# EAGLE design drv8353 based bldc driver stage (EAGLE 9.5.0)

## Sheet 1 of 3: Gate Driver & Signal Headers
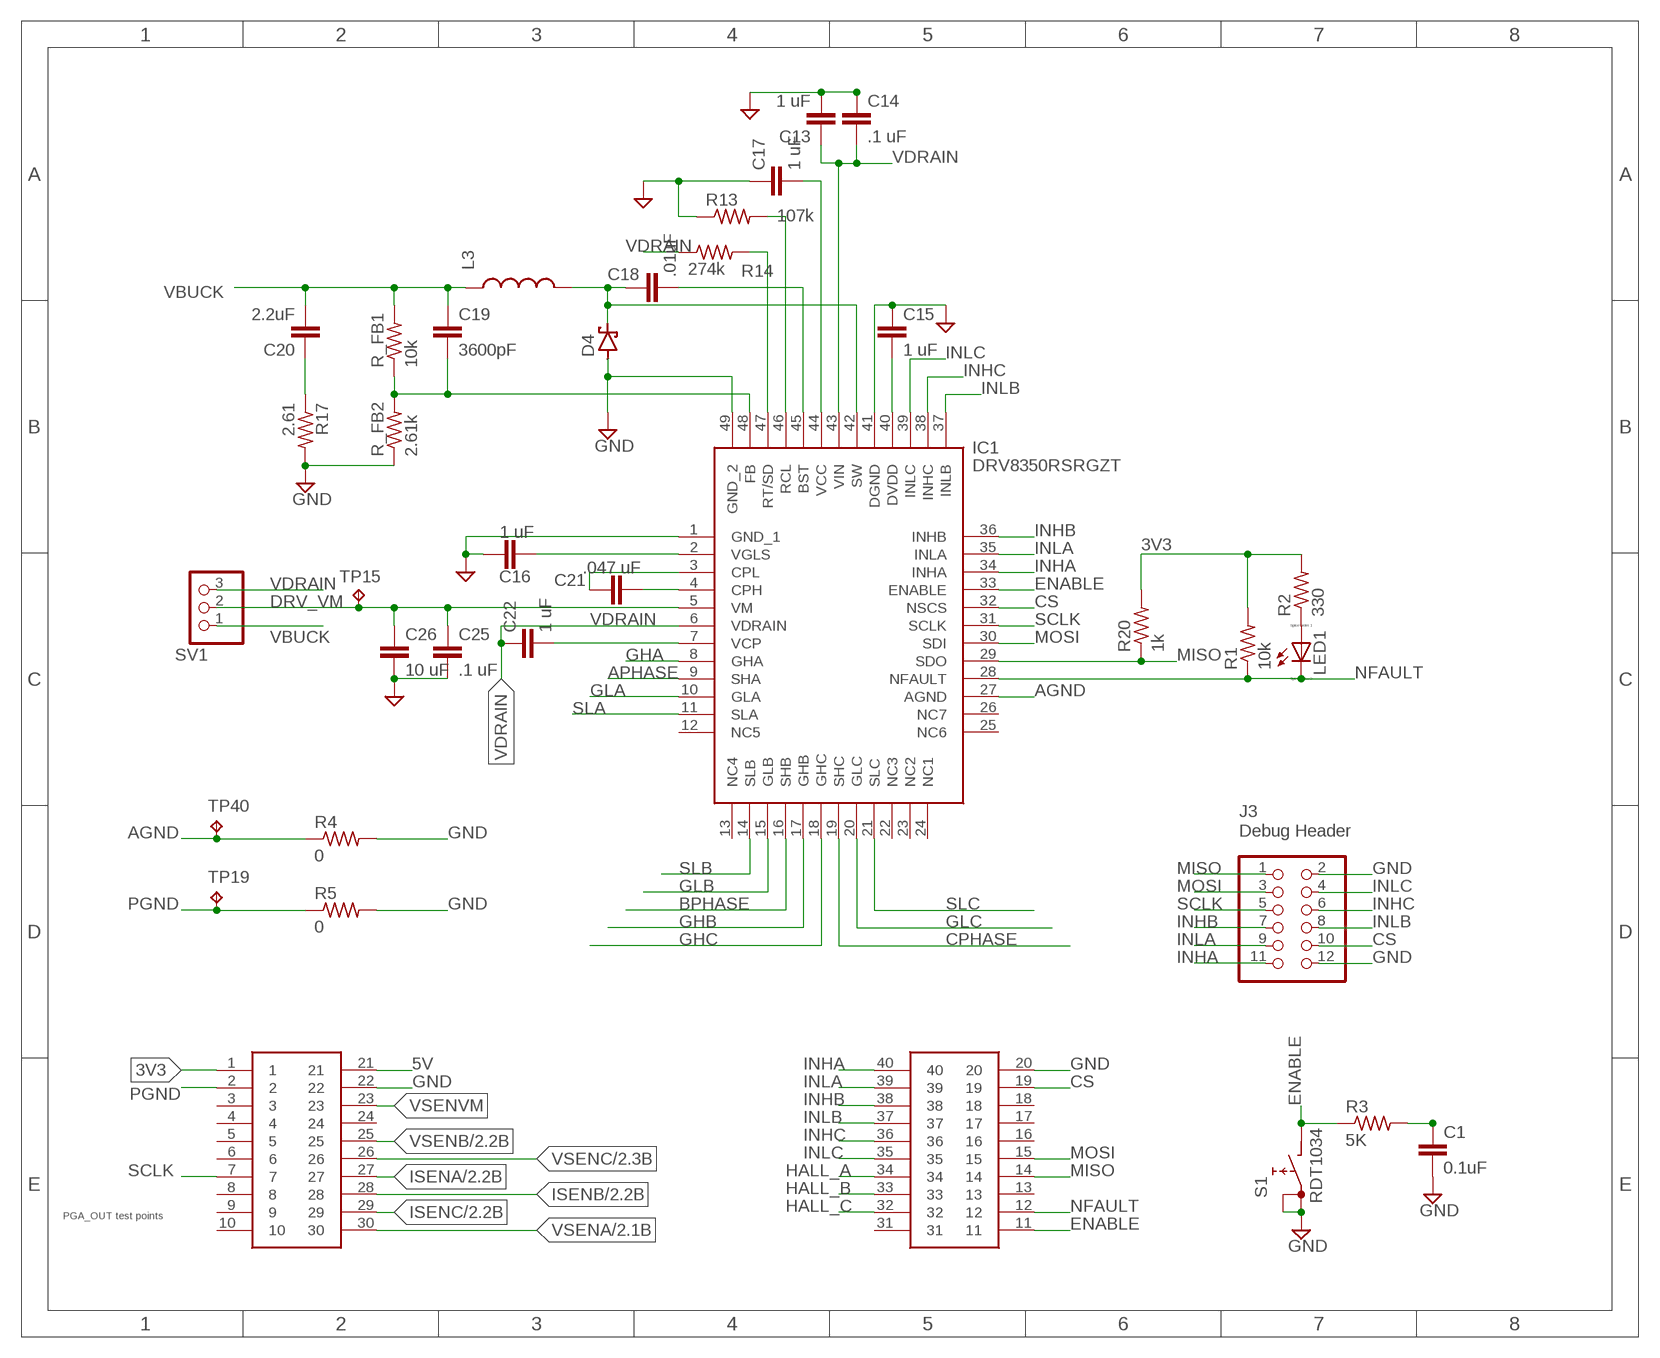
[diagram p0: schematic, sheet 1]

### Parts
C1  0.1uF  C-EUC0603K  [C0603K]
C13  1 uF  C-EUC1206K  [C1206K]
C14  .1 uF  C-EUC0805K  [C0805K]
C15  1 uF  C-EUC0603K  [C0603K]
C16  1 uF  C-EUC0603K  [C0603K]
C17  1 uF  C-EUC0603K  [C0603K]
C18  .01uF  C-EUC0603K  [C0603K]
C19  3600pF  C-EUC0603K  [C0603K]
C20  2.2uF  C-EUC0805K  [C0805K]
C21  .047 uF  C-EUC0805K  [C0805K]
C22  1 uF  C-EUC0603K  [C0603K]
C25  .1 uF  C-EUC0805K  [C0805K]
C26  10 uF  C-EUC2220K  [C2220K]
D4  DFLS1200  [DFLS1200]
IC1  DRV8350RSRGZT  [QFN50P700X700X100-49N]
J3  2X6 FEMALE  PINHD-2X6  [2X06]
L3  330 uH  74404084331  [74404084331]
LED1  LED_ESML0603  [LED_SML0603]
R1  10k  R-US_R0603  [R0603]
R2  330  R-US_R0603  [R0603]
R3  5K  R-US_R0603  [R0603]
R4  0  R-US_R0603  [R0603]
R5  0  R-US_R0603  [R0603]
R13  107k  R-US_R0603  [R0603]
R14  274k  R-US_R0603  [R0603]
R17  2.61  R-US_R0603  [R0603]
R20  1k  R-US_R0603  [R0603]
R_FB1  10k  R-US_R0603  [R0603]
R_FB2  2.61k  R-US_R0603  [R0603]
S1  RDT1034  [RDT1034]
SV1  PINHD-1X3  [1X03]
TP15  TPB1,27  [B1,27]
TP19  TPB1,27  [B1,27]
TP40  TPB1,27  [B1,27]
U$2  BOOSTER_DOCK  [BOOSTER_DOCK]

### Nets
3V3: R1.2 R2.2 R20.2 U$2.1 ; also sheet 3
5V: U$2.21 ; also sheet 3
AGND: IC1.27(AGND) R4.1 TP40.TP
APHASE: IC1.9(SHA) ; also sheet 2,3
BPHASE: IC1.16(SHB) ; also sheet 2,3
BST: C18.2 IC1.45(BST)
CPH: C21.2 IC1.4(CPH)
CPHASE: IC1.19(SHC) ; also sheet 2,3
CPL: C21.1 IC1.3(CPL)
CS: IC1.32(NSCS) J3.10 U$2.19
DRV_VM: C25.1 C26.1 IC1.5(VM) SV1.2 TP15.TP
ENABLE: IC1.33(ENABLE) R3.1 S1.B U$2.11
FB: C19.2 IC1.48(FB) R_FB1.1 R_FB2.2
GHA: IC1.8(GHA) ; also sheet 3
GHB: IC1.17(GHB) ; also sheet 3
GHC: IC1.18(GHC) ; also sheet 3
GLA: IC1.10(GLA) ; also sheet 3
GLB: IC1.15(GLB) ; also sheet 3
GLC: IC1.20(GLC) ; also sheet 3
GND: C1.2 C13.2 C14.1 C15.1 C16.1 C17.1 C25.2 C26.2 D4.GND IC1.1(GND_1) IC1.41(DGND) IC1.49(GND_2) J3.2 J3.12 R4.2 R5.2 R13.1 R17.2 R_FB2.1 S1.A S1.A1 U$2.20 U$2.22 ; also sheet 2,3
HALL_A: U$2.34 ; also sheet 3
HALL_B: U$2.33 ; also sheet 3
HALL_C: U$2.32 ; also sheet 3
INHA: IC1.34(INHA) J3.11 U$2.40
INHB: IC1.36(INHB) J3.7 U$2.38
INHC: IC1.38(INHC) J3.6 U$2.36
INLA: IC1.35(INLA) J3.9 U$2.39
INLB: IC1.37(INLB) J3.8 U$2.37
INLC: IC1.39(INLC) J3.4 U$2.35
ISENA: U$2.27 ; also sheet 2
ISENB: U$2.28 ; also sheet 2
ISENC: U$2.29 ; also sheet 2
MISO: IC1.29(SDO) J3.1 R20.1 U$2.14
MOSI: IC1.30(SDI) J3.3 U$2.15
N$1: C15.2 IC1.40(DVDD)
N$14: C20.1 R17.1
N$16: LED1.A R2.1
N$20: C1.1 R3.2
NFAULT: IC1.28(NFAULT) LED1.C R1.1 U$2.12
PGND: R5.1 TP19.TP U$2.2
RCL: IC1.46(RCL) R13.2
RT/SD: IC1.47(RT/SD) R14.2
SCLK: IC1.31(SCLK) J3.5 U$2.7
SLA: IC1.11(SLA) ; also sheet 3
SLB: IC1.14(SLB) ; also sheet 3
SLC: IC1.21(SLC) ; also sheet 3
SW: C18.1 D4.LINE IC1.42(SW) L3.P$2
VBUCK: C19.1 C20.2 L3.P$1 R_FB1.2 SV1.1 ; also sheet 3
VCC: C17.2 IC1.44(VCC)
VCP: C22.2 IC1.7(VCP)
VDRAIN [vdrain]: C13.1 C14.2 C22.1 IC1.6(VDRAIN) IC1.43(VIN) R14.1 SV1.3 ; also sheet 3
VGLS: C16.2 IC1.2(VGLS)
VSENA: U$2.30 ; also sheet 2,3
VSENB: U$2.25 ; also sheet 2,3
VSENC: U$2.26 ; also sheet 2,3
VSENVM: U$2.23 ; also sheet 3
Unconnected: IC1.12(NC5) IC1.13(NC4) IC1.22(NC3) IC1.23(NC2) IC1.24(NC1) IC1.25(NC6) IC1.26(NC7) U$2.3 U$2.4 U$2.5 U$2.6 U$2.8 U$2.9 U$2.10 U$2.13 U$2.16 U$2.17 U$2.18 U$2.24 U$2.31

### Notes on the sheet
- Debug Header
- PGA_OUT test points

## Sheet 2 of 3: Half Bridges
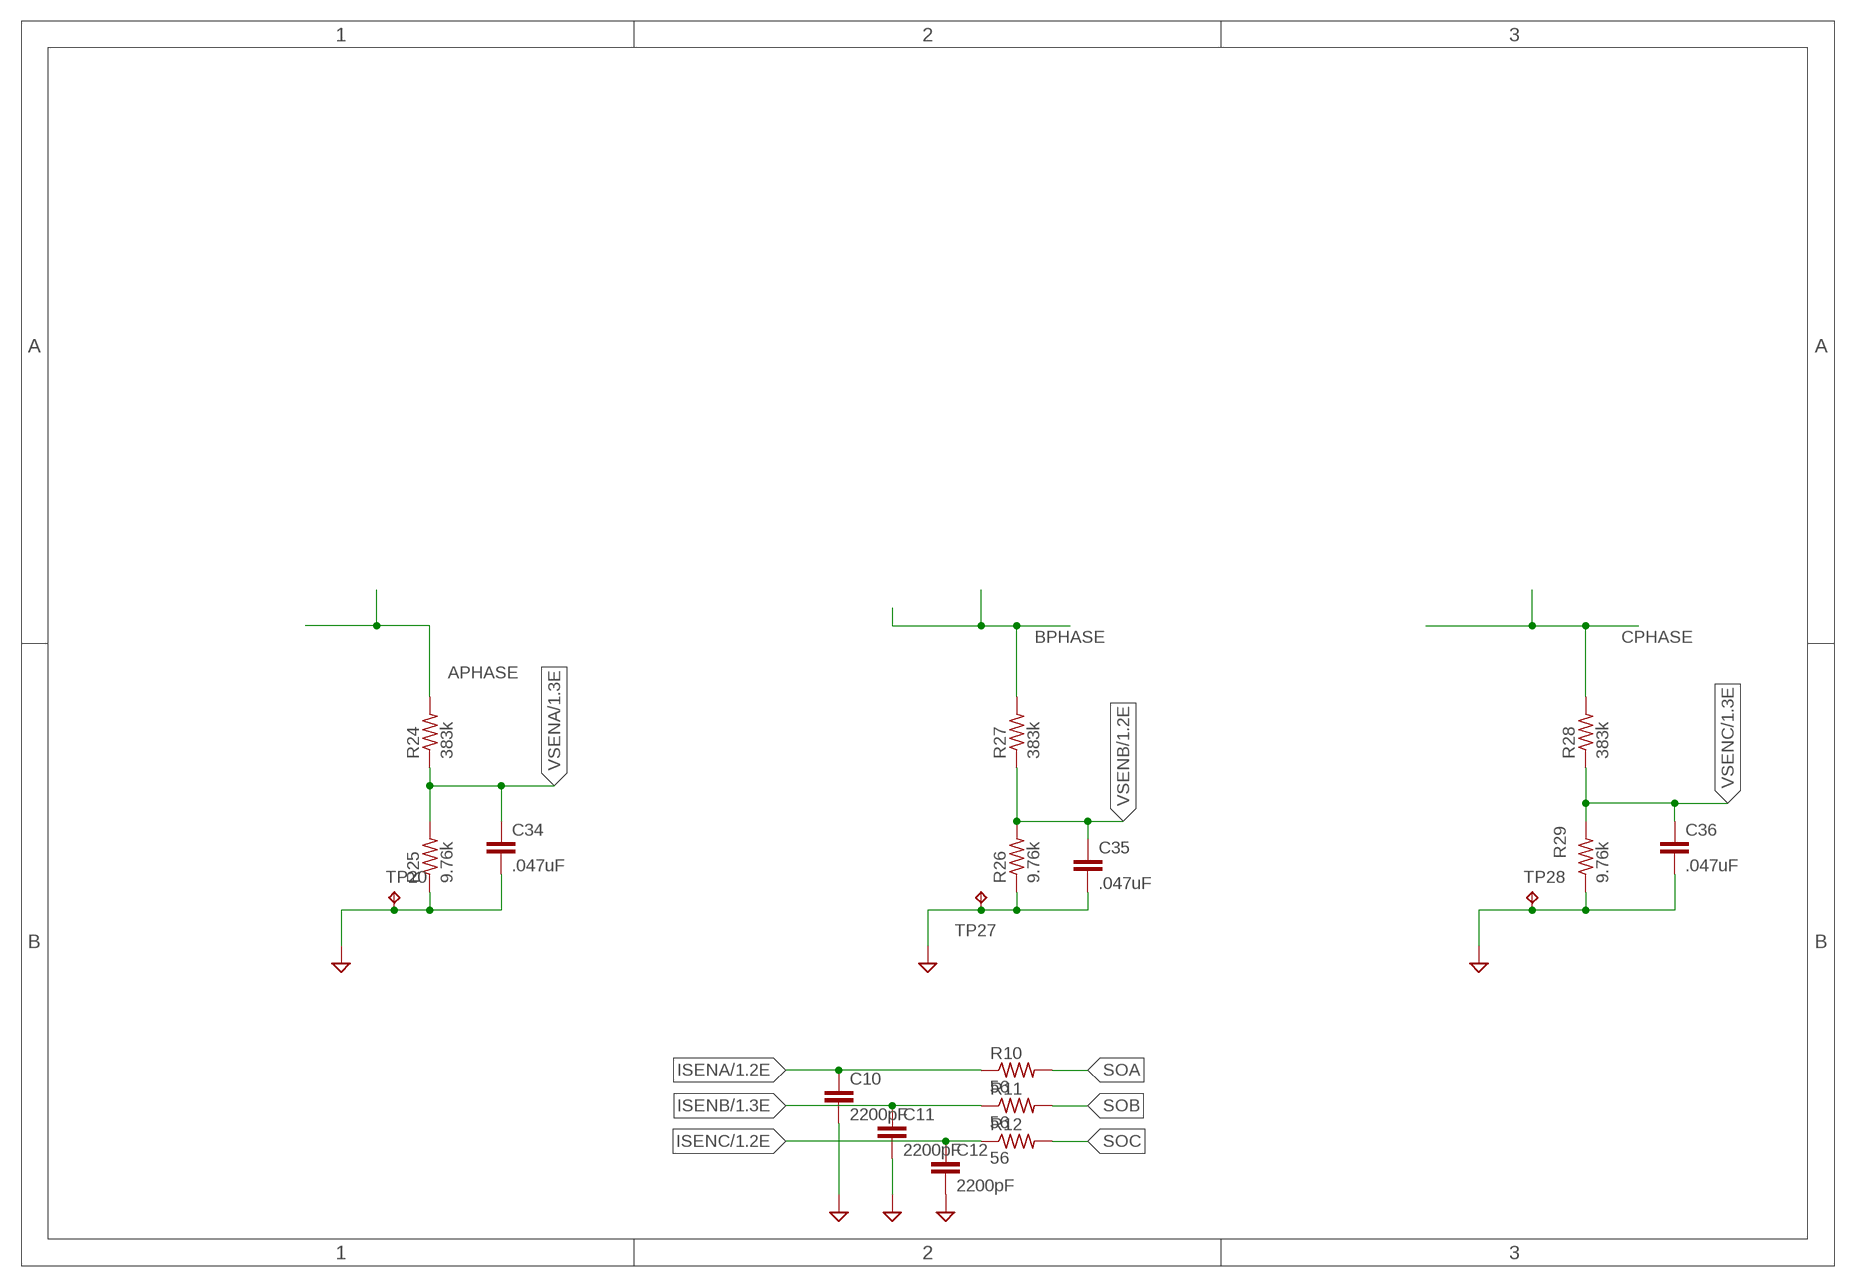
[diagram p1: schematic, sheet 2]

### Parts
C10  2200pF  C-EUC0603K  [C0603K]
C11  2200pF  C-EUC0603K  [C0603K]
C12  2200pF  C-EUC0603K  [C0603K]
C34  .047uF  C-EUC0603K  [C0603K]
C35  .047uF  C-EUC0603K  [C0603K]
C36  .047uF  C-EUC0603K  [C0603K]
R10  56  R-US_R0603  [R0603]
R11  56  R-US_R0603  [R0603]
R12  56  R-US_R0603  [R0603]
R24  383k  R-US_R0603  [R0603]
R25  9.76k  R-US_R0603  [R0603]
R26  9.76k  R-US_R0603  [R0603]
R27  383k  R-US_R0603  [R0603]
R28  383k  R-US_R0603  [R0603]
R29  9.76k  R-US_R0603  [R0603]
TP20  TPB1,27  [B1,27]
TP27  TPB1,27  [B1,27]
TP28  TPB1,27  [B1,27]

### Nets
APHASE: R24.2 ; also sheet 1,3
BPHASE: R27.2 ; also sheet 1,3
CPHASE: R28.2 ; also sheet 1,3
GND: C10.2 C11.2 C12.2 C34.2 C35.2 C36.2 R25.1 R26.1 R29.1 TP20.TP TP27.TP TP28.TP ; also sheet 1,3
ISENA: C10.1 R10.1 ; also sheet 1
ISENB: C11.1 R11.1 ; also sheet 1
ISENC: C12.1 R12.1 ; also sheet 1
SOA: R10.2 ; also sheet 3
SOB: R11.2 ; also sheet 3
SOC: R12.2 ; also sheet 3
VSENA: C34.1 R24.1 R25.2 ; also sheet 1,3
VSENB: C35.1 R26.2 R27.1 ; also sheet 1,3
VSENC: C36.1 R28.1 R29.2 ; also sheet 1,3

## Sheet 3 of 3: Power Connections / Converters
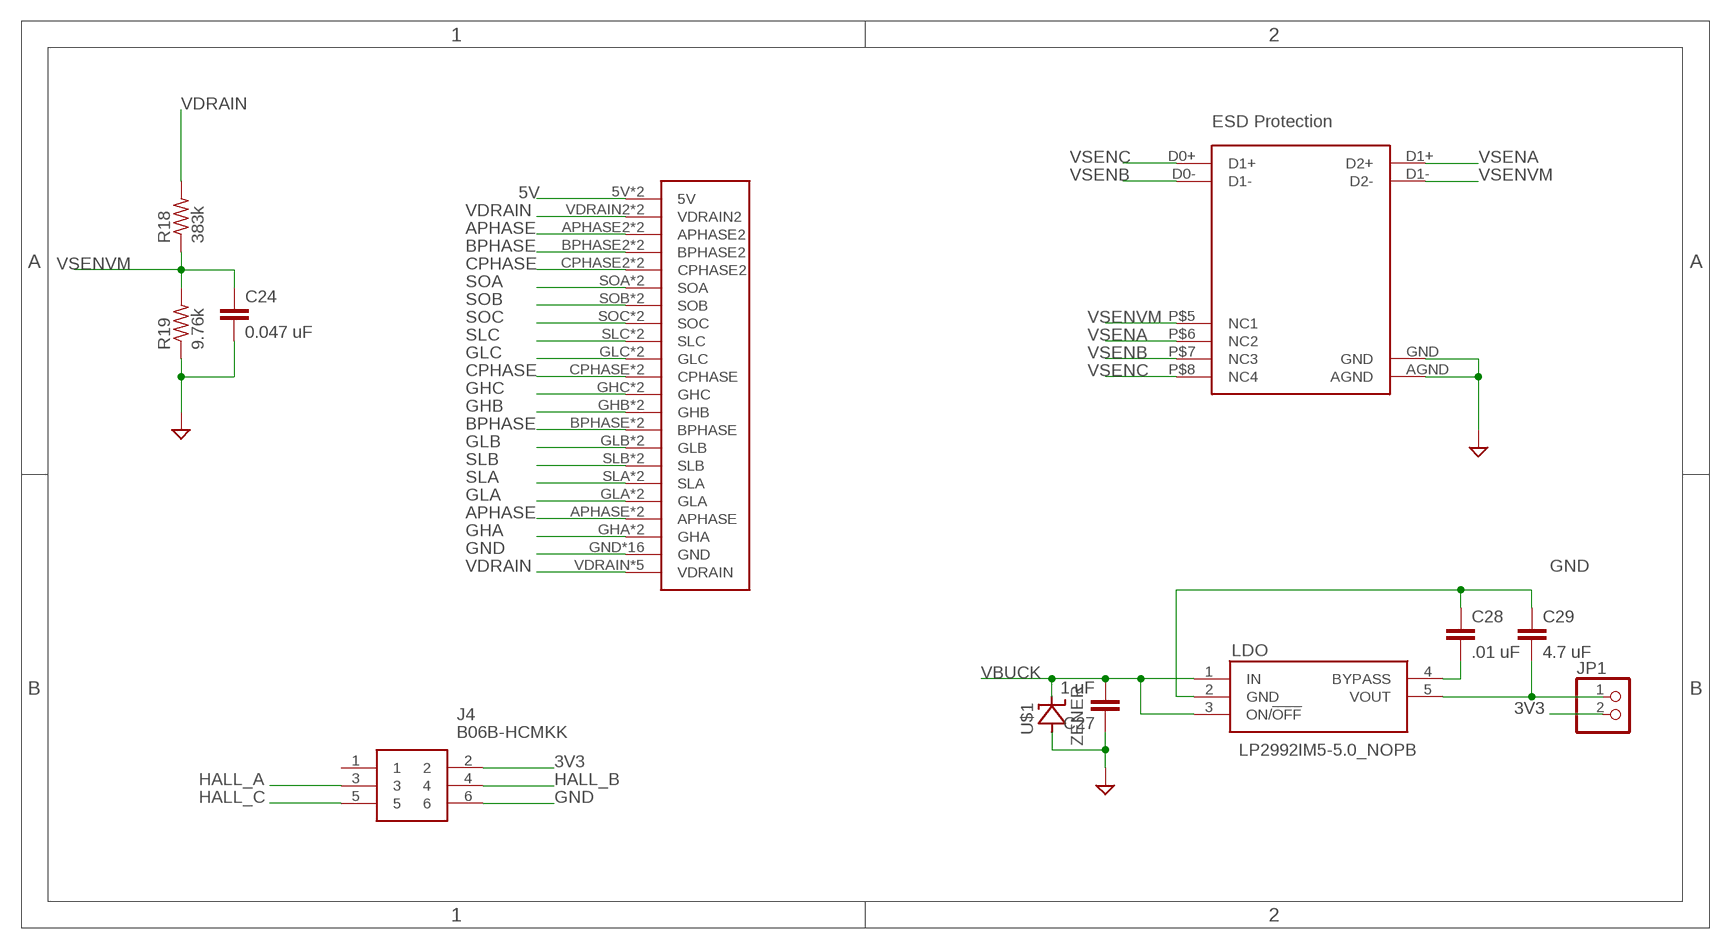
[diagram p2: schematic, sheet 3]

### Parts
C24  0.047 uF  C-EUC0603K  [C0603K]
C27  1 uF  C-EUC0805K  [C0805K]
C28  .01 uF  C-EUC0603K  [C0603K]
C29  4.7 uF  C-EUC1210K  [C1210K]
J4  B06B-HCMKK  [B06BHCMKK]
JP1  PINHD-1X2  [1X02]
LDO  LP2992IM5-5.0_NOPB  [SOT95P280X145-5N]
R18  383k  R-US_R0603  [R0603]
R19  9.76k  R-US_R0603  [R0603]
TVS_DIODE  TPD4S010DQAR  [TPD4S010DQAR]
U$1  ZENER  [SOD123]
U$3  DRIVER_STAGE_CONNECTORDRIVER  [DRIVER_STAGE_CONNECTION]

### Nets
3V3: J4.2 JP1.2 ; also sheet 1
5V: U$3.5V U$3.5VH(5V) ; also sheet 1
APHASE: U$3.APHASE U$3.APHASE2 U$3.APHASE2H(APHASE2) U$3.APHASEH(APHASE) ; also sheet 1,2
BPHASE: U$3.BPHASE U$3.BPHASE2 U$3.BPHASE2H(BPHASE2) U$3.BPHASEH(BPHASE) ; also sheet 1,2
CPHASE: U$3.CPHASE U$3.CPHASE2 U$3.CPHASE2H(CPHASE2) U$3.CPHASEH(CPHASE) ; also sheet 1,2
GHA: U$3.GHA U$3.GHAH(GHA) ; also sheet 1
GHB: U$3.GHB U$3.GHBH(GHB) ; also sheet 1
GHC: U$3.GHC U$3.GHCH(GHC) ; also sheet 1
GLA: U$3.GLA U$3.GLAH(GLA) ; also sheet 1
GLB: U$3.GLB U$3.GLBH(GLB) ; also sheet 1
GLC: U$3.GLC U$3.GLCH(GLC) ; also sheet 1
GND: C24.2 C27.1 C28.1 C29.1 J4.6 LDO.2(GND) R19.1 TVS_DIODE.AGND TVS_DIODE.GND U$1.2(A) U$3.GND U$3.GND2(GND) U$3.GND2H1(GND) U$3.GND2H2(GND) U$3.GND2H3(GND) U$3.GND2H4(GND) U$3.GND2H5(GND) U$3.GND2H6(GND) U$3.GND2H7(GND) U$3.GND2H8(GND) U$3.GND2H9(GND) U$3.GND2H10(GND) U$3.GNDH1(GND) U$3.GNDH2(GND) U$3.GNDH3(GND) U$3.GNDH4(GND) ; also sheet 1,2
HALL_A: J4.3 ; also sheet 1
HALL_B: J4.4 ; also sheet 1
HALL_C: J4.5 ; also sheet 1
N$2: C29.2 JP1.1 LDO.5(VOUT)
N$13: C28.2 LDO.4(BYPASS)
SLA: U$3.SLA U$3.SLAH(SLA) ; also sheet 1
SLB: U$3.SLB U$3.SLBH(SLB) ; also sheet 1
SLC: U$3.SLC U$3.SLCH(SLC) ; also sheet 1
SOA: U$3.SOA U$3.SOAH(SOA) ; also sheet 2
SOB: U$3.SOB U$3.SOBH(SOB) ; also sheet 2
SOC: U$3.SOC U$3.SOCH(SOC) ; also sheet 2
VBUCK: C27.2 LDO.1(IN) LDO.3(ON/!OFF) U$1.LINE ; also sheet 1
VDRAIN [vdrain]: R18.2 U$3.VDRAIN U$3.VDRAIN2 U$3.VDRAIN2H(VDRAIN2) U$3.VDRAINH1(VDRAIN) U$3.VDRAINH2(VDRAIN) U$3.VDRAINH3(VDRAIN) U$3.VDRAINH4(VDRAIN) ; also sheet 1
VSENA: TVS_DIODE.D1+(D2+) TVS_DIODE.P$6(NC2) ; also sheet 1,2
VSENB: TVS_DIODE.D0-(D1-) TVS_DIODE.P$7(NC3) ; also sheet 1,2
VSENC: TVS_DIODE.D0+(D1+) TVS_DIODE.P$8(NC4) ; also sheet 1,2
VSENVM: C24.1 R18.1 R19.2 TVS_DIODE.D1-(D2-) TVS_DIODE.P$5(NC1) ; also sheet 1
Unconnected: J4.1

### Notes on the sheet
- ESD Protection

## Library data of the parts
C1 C14 C22 = resistor:C-EU: CAPACITOR, European symbol
C10-C13 C15-C21 C24-C29 C34-C36 = rcl:C-EU: CAPACITOR, European symbol; SPICEPREFIX: C
D4 = REV BLDC:DFLS1200; SPICEPREFIX: B
IC1 = REV BLDC:DRV8350RSRGZT: 100-V Three-Phase Smart Gate Driver With Buck Regulator and Three Current Shunt Amplifiers Source: Datasheet <http://www.ti.com/lit/gpn/drv8353r>; DESCRIPTION: 100-V Three-Phase Smart Gate Driver With Buck Regulator and Three Current Shunt Amplifiers; HEIGHT: 1mm; MANUFACTURER_NAME: Texas Instruments; MANUFACTURER_PART_NUMBER: DRV8353RSRGZT; MOUSER_PART_NUMBER: 595-DRV8353RSRGZT; MOUSER_PRICE-STOCK: https://www.mouser.com/Search/Refine.aspx?Keyword=595-DRV8353RSRGZT
J3 = pinhead:PINHD-2X6: PIN HEADER
J4 = SamacSys_Parts:B06B-HCMKK: Automotive Connectors 6P AIT Header Top Position (BLK) Source: Datasheet <https://componentsearchengine.com/Datasheets/1/B06B-HCMKK.pdf>; DESCRIPTION: Automotive Connectors 6P AIT Header Top Position (BLK); HEIGHT: 13.7mm; MANUFACTURER_NAME: JST (JAPAN SOLDERLESS TERMINALS); MANUFACTURER_PART_NUMBER: B06B-HCMKK; MOUSER_PART_NUMBER: 306-B06B-HCMKK; MOUSER_PRICE-STOCK: https://www.mouser.com/Search/Refine.aspx?Keyword=306-B06B-HCMKK
JP1 = pinhead:PINHD-1X2: PIN HEADER
L3 = REV BLDC:74404084331
LDO = SamacSys_Parts:LP2992IM5-5.0_NOPB: Micropower 250 mA Low-Noise Ultra Low-Dropout Regulator Source: Datasheet <http://www.ti.com/lit/ds/symlink/lp2992.pdf>; DESCRIPTION: Micropower 250 mA Low-Noise Ultra Low-Dropout Regulator; HEIGHT: 1.45mm; MANUFACTURER_NAME: Texas Instruments; MANUFACTURER_PART_NUMBER: LP2992IM5-5.0/NOPB; MOUSER_PART_NUMBER: 926-2992IM5-5.0/NOPB; MOUSER_PRICE-STOCK: https://www.mouser.com/Search/Refine.aspx?Keyword=926-2992IM5-5.0%2FNOPB
LED1 = eagle-ltspice:LED_E: LED Source: http://www.osram.convergy.de Source: www.luxeon.com Source: www.kingbright.com; SPICEMODEL: NONE; SPICEPREFIX: D; SPICETYPE: diode
R1 R2 R10-R14 R17-R20 R24-R29 R_FB1 R_FB2 = rcl:R-US_: RESISTOR, American symbol; SPICEPREFIX: R
R3-R5 = resistor:R-US_: RESISTOR, American symbol
S1 = switch:RDT1034: PUSH SWITCH www.radiohm.com
SV1 = pinhead:PINHD-1X3: PIN HEADER
TP15 TP19 TP20 TP27 TP28 TP40 = testpad:TP: Test pad
TVS_DIODE = REV BLDC:TPD4S010DQAR
U$1 = REV BLDC:ZENER
U$2 = REV BLDC:BOOSTER_DOCK
U$3 = REV BLDC:DRIVER_STAGE_CONNECTOR

## Net classes
1 vdrain: clearance 0.2 mm

## Board
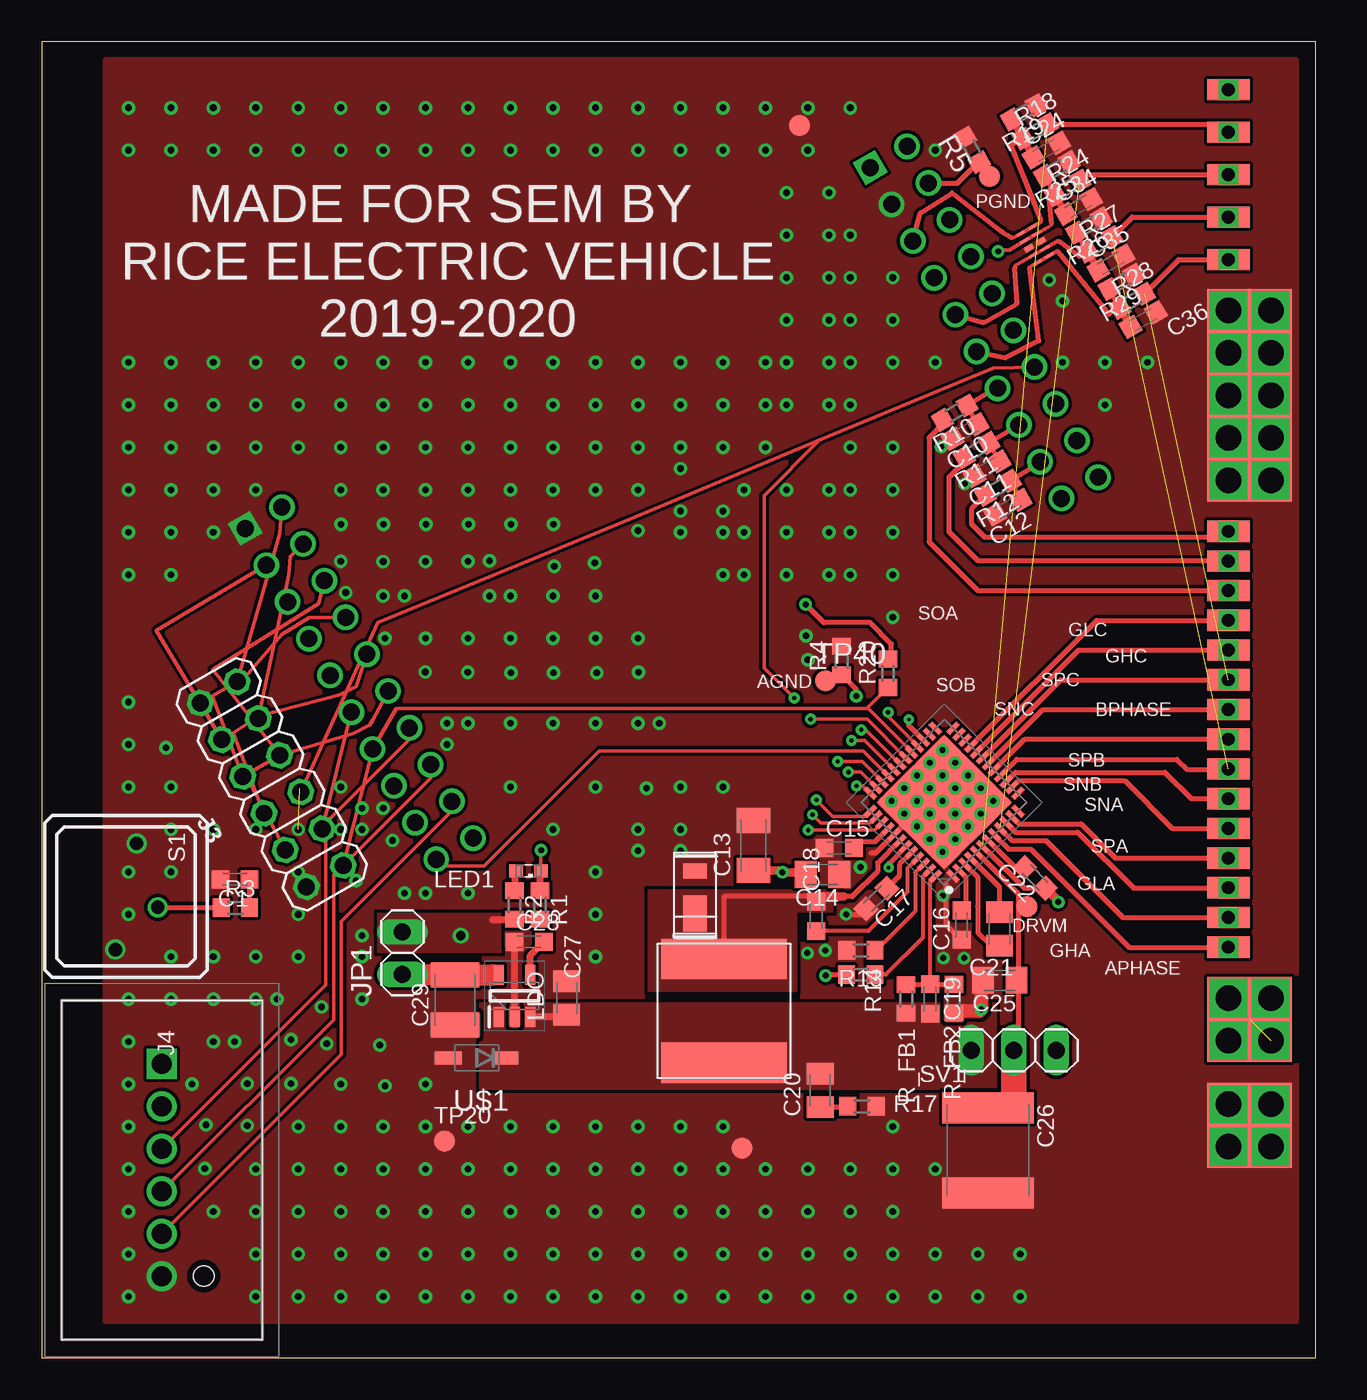
[diagram p3: board, top side]
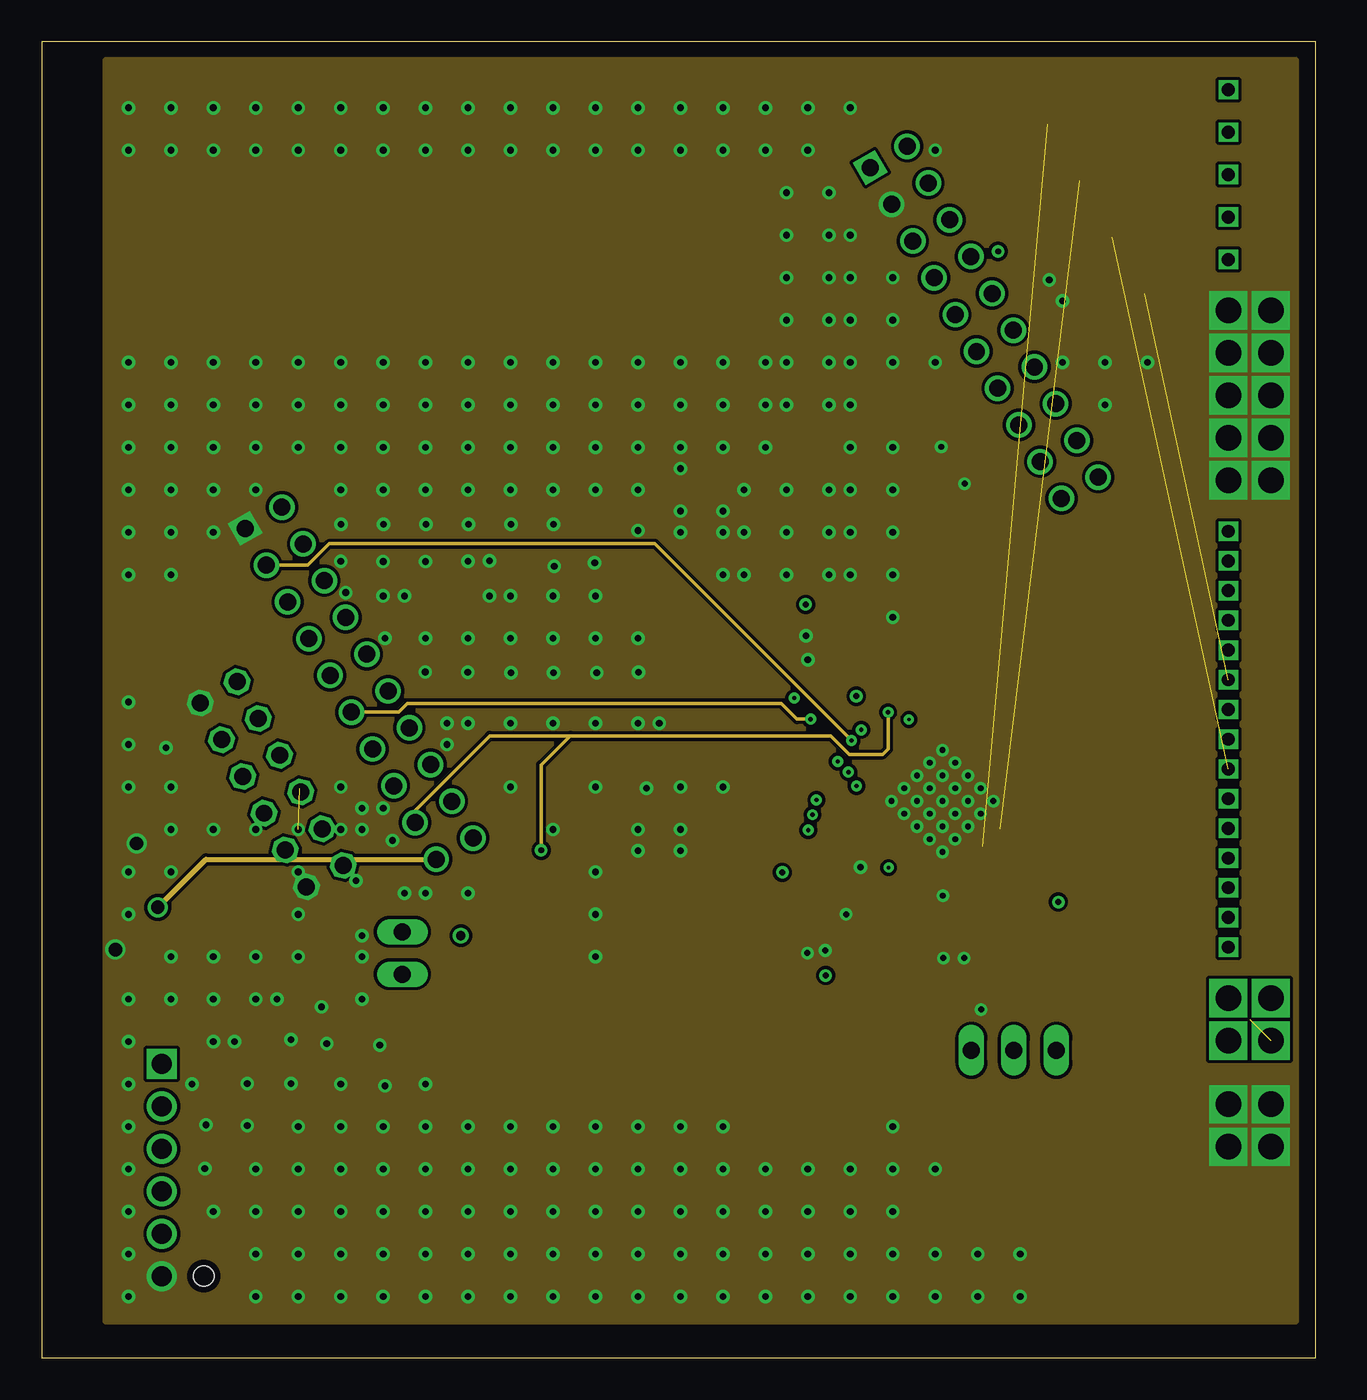
[diagram p4: board, inner layer Route2]
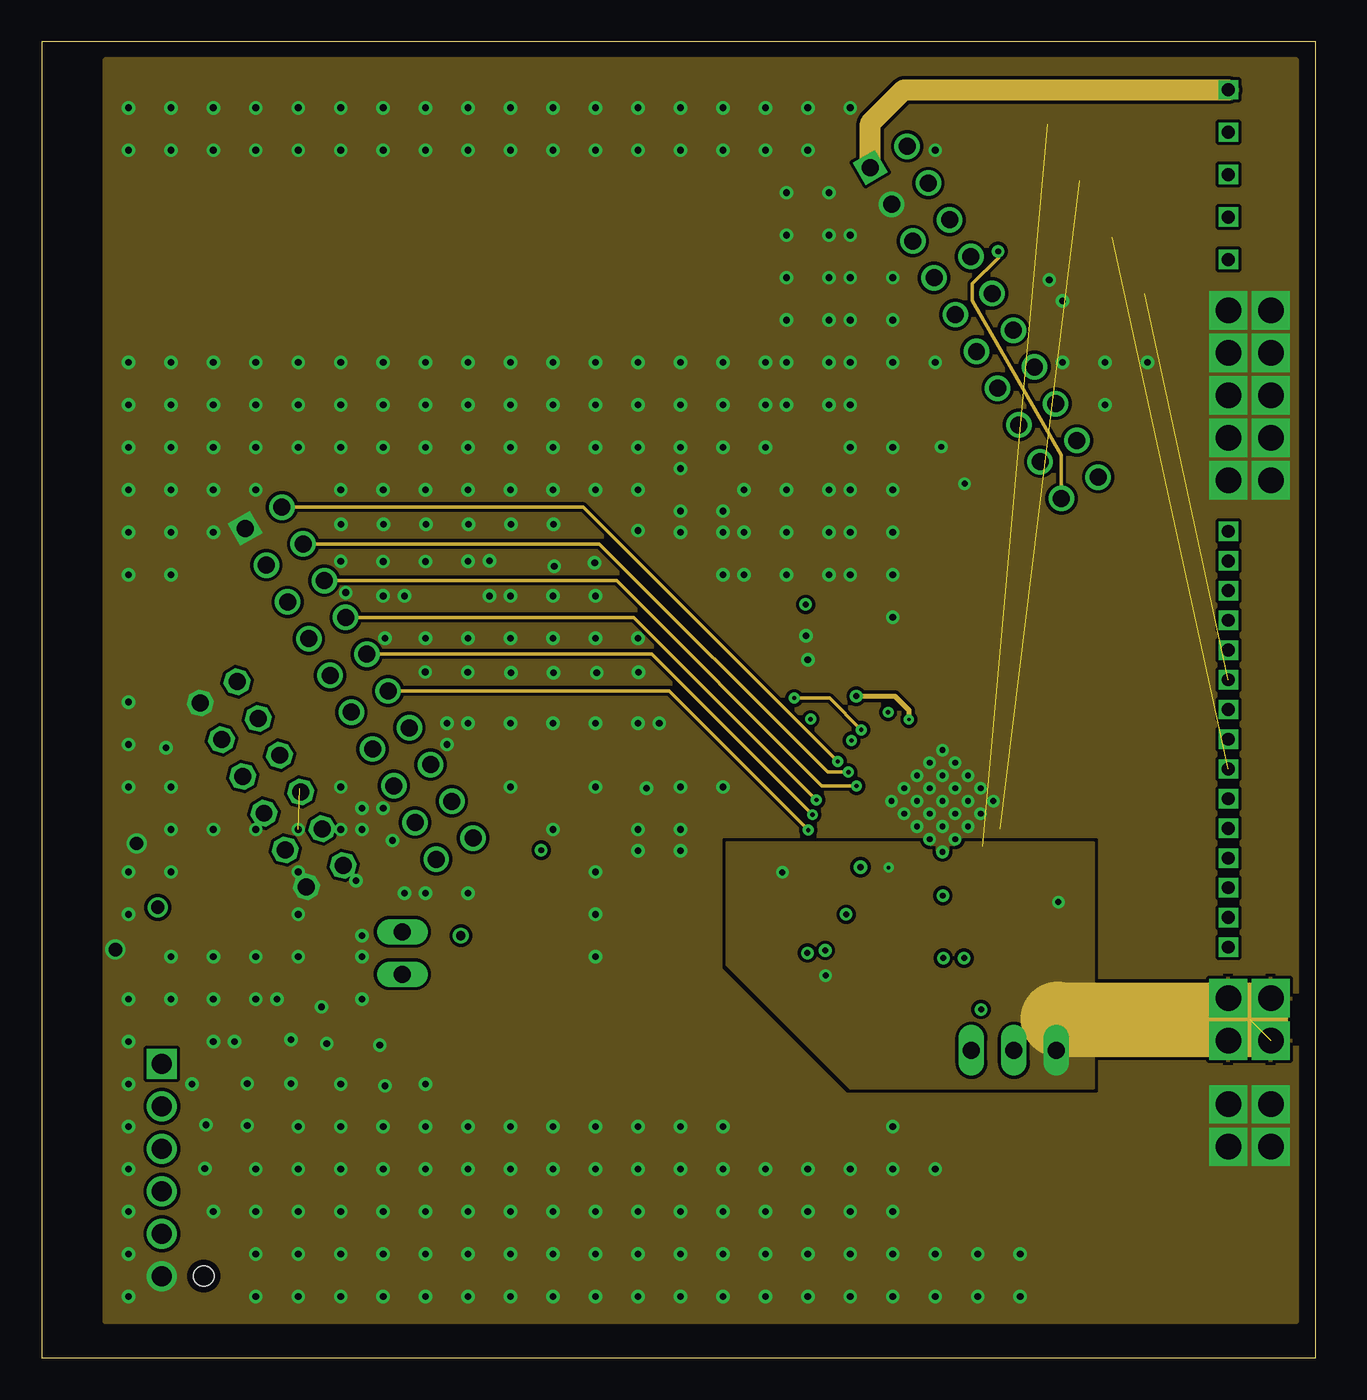
[diagram p5: board, inner layer Route15]
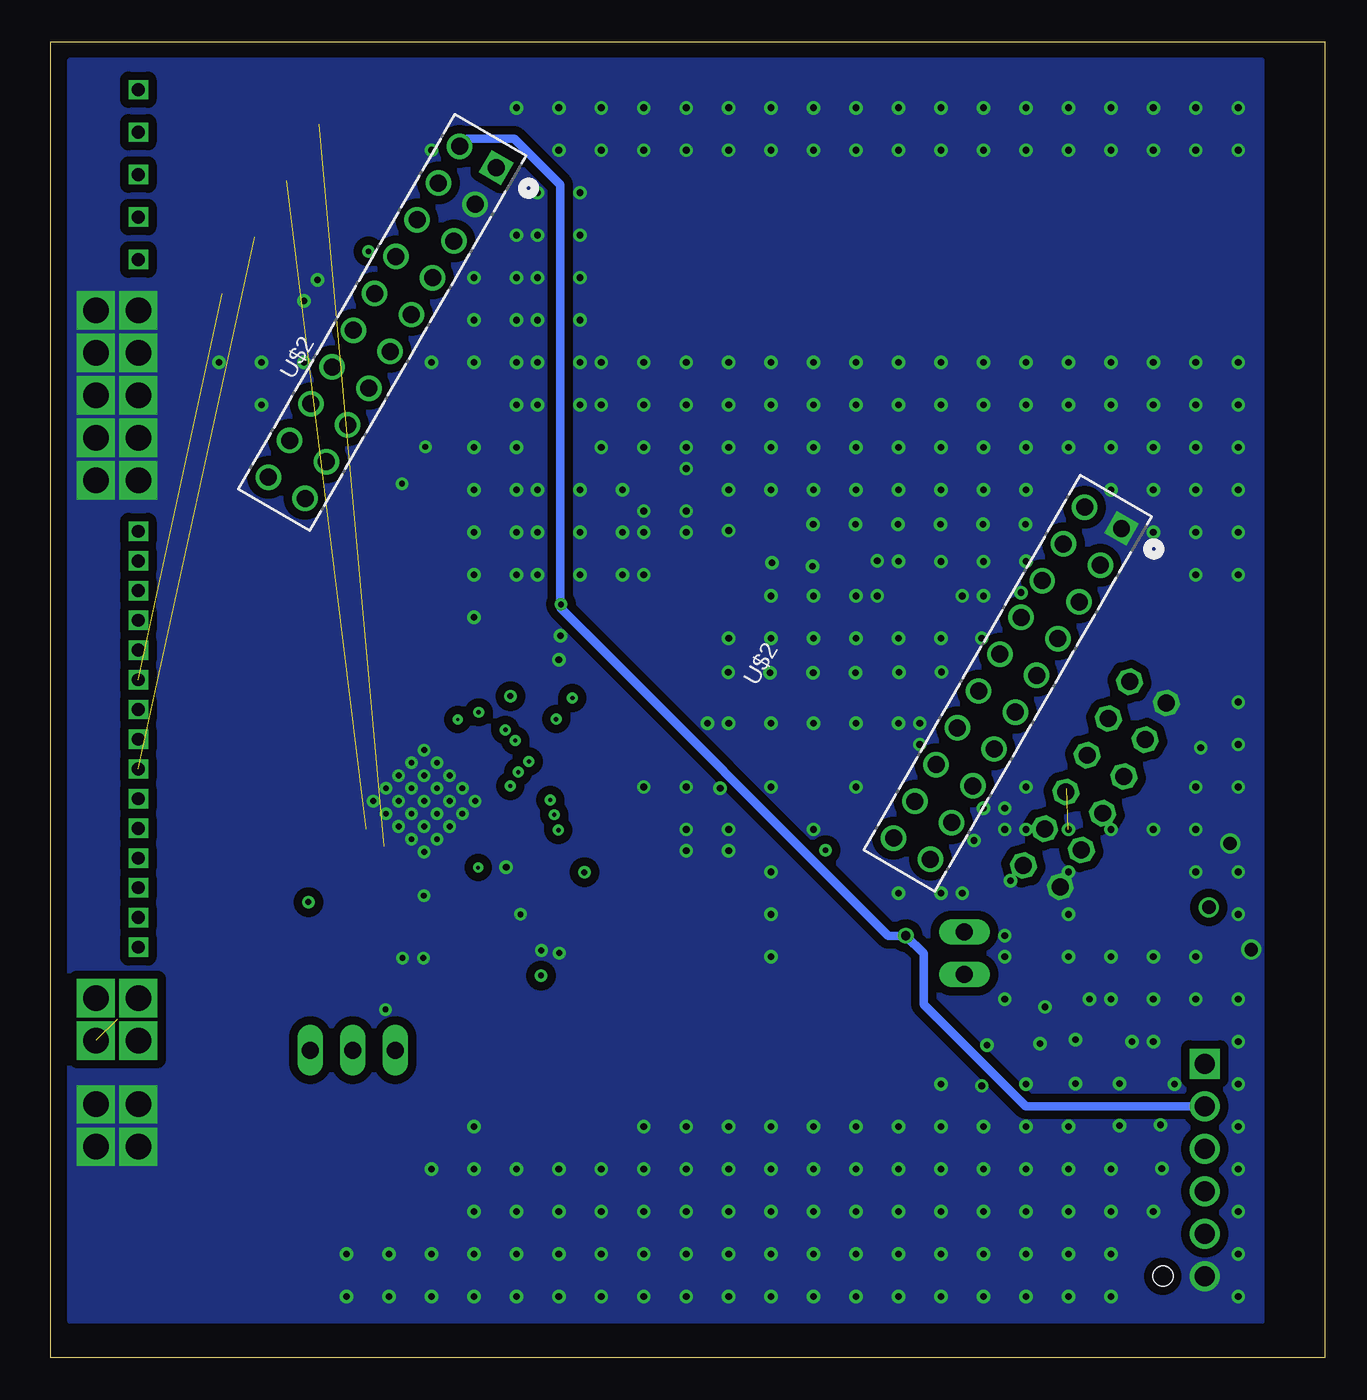
[diagram p6: board, bottom side, seen from below]

Size 76.2 x 78.74 mm. Coordinates in mm from the lower left corner, seen from the top.
Outline: 0,0 76.2,0 76.2,78.74 0,78.74 0,0
Copper layers (1+2*15+16): Top 0.035mm / dielectric 0.1mm / Route2 0.0175mm / dielectric 0.5mm / Route15 0.0175mm / dielectric 0.1mm / Bottom 0.035mm
Design rules "default *": minimum track width 0.2mm, minimum drill 0.2mm, track to track 0.2mm, track to pad 0.2mm, pad to pad 0.2mm, via to via 0.2mm, smd to smd 6mil, copper to edge 15mil, drill to drill 6mil, minimum pad ring 0.2mm, minimum via ring 0.2mm, stop-mask expansion 4mil, vias tented up to drill 0mil, thermal gap 10mil

### Footprints (pad centres in the part's own frame; a part is rotated, then mirrored left to right if it is on the bottom)
C0603K = smd 1.05 x 1.08: 1 -0.875,0; 2 0.875,0
C1206K = smd 1.5 x 2: 1 -1.5,0; 2 1.5,0
C0805K = smd 1.3 x 1.6: 1 -1,0; 2 1,0
C2220K = smd 1.85 x 5.5: 1 -2.55,0; 2 2.55,0
C1210K = smd 1.5 x 2.9: 1 -1.5,0; 2 1.5,0
DFLS1200 = smd 0.9 x 1.4: GND 1.45,0 | smd 2.2 x 1.4: LINE -1.1,0
QFN50P700X700X100-49N = smd 0.85 x 0.3: 1 -3.5,2.75; 2 -3.5,2.25; 3 -3.5,1.75; 4 -3.5,1.25; 5 -3.5,0.75; 6 -3.5,0.25; 7 -3.5,-0.25; 8 -3.5,-0.75; 9 -3.5,-1.25; 10 -3.5,-1.75; 11 -3.5,-2.25; 12 -3.5,-2.75; 25 3.5,-2.75; 26 3.5,-2.25; 27 3.5,-1.75; 28 3.5,-1.25; 29 3.5,-0.75; 30 3.5,-0.25; 31 3.5,0.25; 32 3.5,0.75; 33 3.5,1.25; 34 3.5,1.75; 35 3.5,2.25; 36 3.5,2.75 | smd 0.3 x 0.85: 13 -2.75,-3.5; 14 -2.25,-3.5; 15 -1.75,-3.5; 16 -1.25,-3.5; 17 -0.75,-3.5; 18 -0.25,-3.5; 19 0.25,-3.5; 20 0.75,-3.5; 21 1.25,-3.5; 22 1.75,-3.5; 23 2.25,-3.5; 24 2.75,-3.5; 37 2.75,3.5; 38 2.25,3.5; 39 1.75,3.5; 40 1.25,3.5; 41 0.75,3.5; 42 0.25,3.5; 43 -0.25,3.5; 44 -0.75,3.5; 45 -1.25,3.5; 46 -1.75,3.5; 47 -2.25,3.5; 48 -2.75,3.5 | smd 5.7 x 5.7: 49 0,0
2X06 = drill 1.016 octagon: 1 -6.35,-1.27; 2 -6.35,1.27; 3 -3.81,-1.27; 4 -3.81,1.27; 5 -1.27,-1.27; 6 -1.27,1.27; 7 1.27,-1.27; 8 1.27,1.27; 9 3.81,-1.27; 10 3.81,1.27; 11 6.35,-1.27; 12 6.35,1.27
B06BHCMKK = drill 1.2 pad 1.8 square: 1 0,0 | drill 1.2 pad 1.8: 2 2.54,0; 3 5.08,0; 4 7.62,0; 5 10.16,0; 6 12.7,0 | hole 1.2: 12.7,2.5
1X02 = drill 1.016 long: 1 -1.27,0; 2 1.27,0
74404084331 = smd 2.4 x 7.5: P$1 -3.1,0; P$2 3.1,0
SOT95P280X145-5N = smd 1.2 x 0.6: 1 -1.25,0.95; 2 -1.25,0; 3 -1.25,-0.95; 4 1.25,-0.95; 5 1.25,0.95
LED_SML0603 = smd 0.8 x 0.8: A 0.75,0; C -0.75,0
R0603 = smd 1 x 1.1: 1 -0.85,0; 2 0.85,0
RDT1034 = drill 0.8: A 3.175,-0.635; A1 -3.175,0.635; B 0.65,1.9
1X03 = drill 1.016 long: 1 -2.54,0; 2 0,0; 3 2.54,0
B1,27 = smd 1.27 x 1.27: TP 0,0
TPD4S010DQAR = smd 0.565 x 0.38: AGND -0.417,0; GND 0.417,0 | smd 0.565 x 0.2: D0+ 0.417,-1; D0- 0.417,-0.5; D1+ 0.417,0.5; D1- 0.417,1; P$5 -0.417,1; P$6 -0.417,0.5; P$7 -0.417,-0.5; P$8 -0.417,-1
SOD123 = smd 1.6 x 0.8: 2 1.7,0; LINE -1.7,0
BOOSTER_DOCK = drill 1.016 pad 1.524: 1 -22.86,11.43; 2 -22.86,8.89; 3 -22.86,6.35; 4 -22.86,3.81; 5 -22.86,1.27; 6 -22.86,-1.27; 7 -22.86,-3.81; 8 -22.86,-6.35; 9 -22.86,-8.89; 10 -22.86,-11.43; 11 22.86,-11.43; 12 22.86,-8.89; 13 22.86,-6.35; 14 22.86,-3.81; 15 22.86,-1.27; 16 22.86,1.27; 17 22.86,3.81; 18 22.86,6.35; 19 22.86,8.89; 22 -20.32,8.89; 23 -20.32,6.35; 24 -20.32,3.81; 25 -20.32,1.27; 26 -20.32,-1.27; 27 -20.32,-3.81; 28 -20.32,-6.35; 29 -20.32,-8.89; 30 -20.32,-11.43; 31 20.32,-11.43; 32 20.32,-8.89; 33 20.32,-6.35; 34 20.32,-3.81; 35 20.32,-1.27; 36 20.32,1.27; 37 20.32,3.81; 38 20.32,6.35; 39 20.32,8.89; 40 20.32,11.43 | drill 1.016 pad 1.524 square: 20 22.86,11.43; 21 -20.32,11.43
DRIVER_STAGE_CONNECTION = smd 2.54 x 1.27: 5V 1.27,52.07; APHASE 1.27,2.54; APHASE2 1.27,46.99; BPHASE 1.27,11.43; BPHASE2 1.27,44.45; CPHASE 1.27,16.764; CPHASE2 1.27,41.91; GHA 1.27,0.762; GHB 1.27,13.208; GHC 1.27,14.986; GLA 1.27,4.318; GLB 1.27,9.652; GLC 1.27,18.542; SLA 1.27,6.096; SLB 1.27,7.874; SLC 1.27,20.32; SOA 1.27,22.098; SOB 1.27,23.876; SOC 1.27,25.654; VDRAIN2 1.27,49.53 | drill 0.762 square: 5VH 1.27,52.07; APHASE2H 1.27,46.99; APHASEH 1.27,2.54; BPHASE2H 1.27,44.45; BPHASEH 1.27,11.43; CPHASE2H 1.27,41.91; CPHASEH 1.27,16.764; GHAH 1.27,0.762; GHBH 1.27,13.208; GHCH 1.27,14.986; GLAH 1.27,4.318; GLBH 1.27,9.652; GLCH 1.27,18.542; SLAH 1.27,6.096; SLBH 1.27,7.874; SLCH 1.27,20.32; SOAH 1.27,22.098; SOBH 1.27,23.876; SOCH 1.27,25.654; VDRAIN2H 1.27,49.53 | smd 5.08 x 5.08: GND 2.54,-9.906; VDRAIN 2.54,-3.556 | smd 5.08 x 12.7: GND2 2.54,33.782 | drill 1.524 square: GND2H1 1.27,28.702; GND2H2 3.81,28.702; GND2H3 1.27,31.242; GND2H4 3.81,31.242; GND2H5 1.27,33.782; GND2H6 3.81,33.782; GND2H7 1.27,36.322; GND2H8 3.81,36.322; GND2H9 1.27,38.862; GND2H10 3.81,38.862; GNDH1 1.27,-11.176; GNDH2 3.81,-11.176; GNDH3 1.27,-8.636; GNDH4 3.81,-8.636; VDRAINH1 1.27,-4.826; VDRAINH2 3.81,-4.826; VDRAINH3 1.27,-2.286; VDRAINH4 3.81,-2.286

### Placement (x,y rotation side)
C1  11.56,28.63 180 top
C10  55.23,55.42 210 top
C11  56.55,53.2 210 top
C12  57.79,50.89 210 top
C13  42.56,30.65 90 top
C14  46.7,28.91 180 top
C15  47.7,30.5 0 top
C16  55.01,25.89 90 top
C17  49.93,27.47 44.6 top
C18  46.32,26.41 270 top
C19  53.13,21.48 90 top
C20  46.56,16 90 top
C21  57.28,25.66 90 top
C22  59.41,28.71 135.1 top
C24  60.08,72.26 30 top
C25  57.3,22.59 180 top
C26  56.6,12.41 270 top
C27  31.39,21.53 270 top
C28  29.15,24.89 0 top
C29  24.71,21.41 90 top
C34  62,68.88 30 top
C35  63.94,65.51 30 top
C36  65.88,62.12 30 top
D4  39.08,27.67 90 top
IC1  53.97,33.24 135 top
J3  13.76,34.32 120 top
J4  7.18,17.58 270 top
JP1  21.56,24.22 90 top
L3  40.81,20.76 90 top
LDO  28.28,21.64 90 top
LED1  29.11,29.13 180 top
R1  29.8,27.09 270 top
R2  28.28,27.09 270 top
R3  11.58,26.92 0 top
R4  47.84,41.72 90 top
R5  55.65,72.28 120 top
R10  54.6,56.55 210 top
R11  55.91,54.32 210 top
R12  57.19,52.05 210 top
R13  48.99,24.38 0 top
R14  48.99,22.92 0 top
R17  49.06,15.05 0 top
R18  59.42,73.37 30 top
R19  58.74,74.52 210 top
R20  50.61,40.95 90 top
R24  61.36,70 30 top
R25  60.71,71.13 210 top
R26  62.62,67.75 210 top
R27  63.28,66.62 30 top
R28  65.23,63.24 30 top
R29  64.57,64.37 210 top
R_FB1  51.7,21.47 270 top
R_FB2  54.55,21.48 90 top
S1  5.04,27.6 270 top
SV1  58.14,18.39 0 top
TP15  58.93,26.98 0 top
TP19  56.69,70.67 0 top
TP20  24.08,12.97 0 top
TP27  45.32,73.75 0 top
TP28  41.89,12.54 0 top
TP40  46.89,40.5 0 top
TVS_DIODE  59.41,66.61 30 top
U$1  26.01,17.94 180 top
U$2  37.68,51.15 330 bottom
U$3  69.7,23.8 0 top

### Tracks (layer width: path | path; a pad name or v marks a point on that pad's centre or on a via)
3V3  (via drill 0.35, 0.55)
  Top 0.305: v45.69,45.07 46.78,43.98 49.55,43.98 50.82,42.71 50.82,42.02 R20.2 50.94,42.13
  Top 0.406: R1.2 R2.2 28.23,26.2 26.95,26.2
  Bottom 0.305: v45.69,45.07 45.69,45.12 45.74,45.12
  Bottom 0.508: J4.2 17.91,15.04 24,21.14 24,24.19 v25.07,25.25 26.11,25.25 45.74,44.89 45.74,45.12 45.74,70.19 48.49,72.94 51.3,72.94 U$2.1
  pour Top (no thermals): 20.09,24.29 27.51,24.29 27.46,24.35 27.46,26.56 20.09,26.56
5V
  Route15 1.27: U$2.21 49.56,73.86 51.57,75.87 U$3.5V
AGND  (via drill 0.2, 0.35)
  Top 0.3: IC1.27 51.87,37.82
  Top 0.305: 51.87,37.82 v51.87,38.19 | v48.72,39.59 48.72,39.99 R4.1 47.25,40.87 TP40.TP
  Route15 0.305: v48.72,39.59 51.03,39.59 51.87,38.75 v51.87,38.19
APHASE  (1 unrouted)
  Top 0.3: IC1.9 58.04,30.94 60.06,30.94 64.66,26.34 U$3.APHASE | R24.2 62.45,70.79 U$3.APHASE2H
  Top 0.305: 62.47,70.8 R24.2
BPHASE  (1 unrouted)
  Top 0.3: IC1.16 58.3,35.8 67.9,35.8 68.5,35.2 70.94,35.2 U$3.BPHASEH | R27.2 65.22,68.25 U$3.BPHASE2H
BST
  Top 0.254: C18.2 49.44,25.54 51.78,27.88 51.78,29.27 IC1.45
CPH
  Top 0.3: IC1.4 57.28,28.16 C21.2
CPHASE  (1 unrouted)
  Top 0.3: IC1.19 60.95,40.56 U$3.CPHASEH | R28.2 68.01,65.71 U$3.CPHASE2
CPL
  Top 0.3: IC1.3 55.98,28.76 55.98,26.98
  Top 0.305: 55.98,26.98 55.98,25.43 56.75,24.66 C21.1
CS  (via drill 0.25)
  Top 0.203: U$2.19 6.86,43.52 J3.10 | 50.97,35.2 IC1.32 49.22,36.94 v48.43,36.94
  Route2 0.203: U$2.19 15.91,47.42 17.19,48.7 36.66,48.7 v48.43,36.94
DRV_VM
  Top 0.2: C26.1 56.87,15.23 58.14,15.23
  Top 0.3: 58.44,22.59 58.44,26.89 | 58.44,26.89 58.44,27.71 IC1.5 | 58.83,26.89 58.44,26.89
  Top 0.305: SV1.2 58.44,18.69 58.44,22.59 C25.1 | TP15.TP 58.83,26.89
  Top 1.524: SV1.2 58.14,15.23 57.94,15.02
ENABLE
  Top 0.203: IC1.33 50.61,34.83 49.13,36.31 33.34,36.31 26.47,29.43 23.99,29.43 U$2.11
  Top 0.305: R3.1 6.96,26.92 S1.B
  Route2 0.305: S1.B 9.81,29.82 U$2.11
FB
  Top 0.2: C19.2 53.15,22.35
  Top 0.254: IC1.48 53.15,28.52 53.15,22.35 | R_FB2.2
  Top 0.305: 51.45,22.56 R_FB1.1 51.73,22.35 C19.2 54.53,22.35 R_FB2.2
GHA
  Top 0.3: IC1.8 57.83,30.44 59.16,30.44 65.04,24.56 U$3.GHAH
GHB
  Top 0.3: IC1.17 58.8,37.01 U$3.GHB
GHC
  Top 0.3: IC1.18 | IC1.18 59.88,38.79 U$3.GHCH
GLA
  Top 0.3: IC1.10 58.24,31.44 61.96,31.44 65.3,28.1 70.95,28.1 U$3.GLA
GLB
  Top 0.3: IC1.15 58.24,35.03 67.17,35.03 68.75,33.45 U$3.GLBH
GLC
  Top 0.3: IC1.20 62.02,42.34 U$3.GLCH
GND  (via drill 0.35, 0.4)  (1 unrouted)
  Top 0.2: C10.2 53.99,54.5 v53.8,54.5 | C11.2 55.33,52.3 v55.2,52.3
  Top 0.3: 49.6,30.2 49.87,30.2 IC1.41 51.57,31.9 51.8,31.9
  Top 0.305: C17.1 48.96,26.5 48.14,26.5 v48.11,26.53 | 54.08,28.4 54.08,25.93 C16.1
  Top 0.406: C14.1 47.33,29.27 | LDO.2 C28.1
  Top 0.508: R_FB2.1 54.66,20.74 | C29.1 24.78,19.91 | 56.18,22.46 C25.2
  Top 0.8: 54.66,20.74 56.08,20.74 v56.18,20.84 56.18,22.46
  other vias: 50.82,33.31 51.59,34.07 52.35,34.84 53.11,35.6 53.87,36.36 54.63,35.6 55.4,34.84 56.16,34.07 56.92,33.31 56.16,32.55 55.4,33.31 54.63,34.07 53.87,34.84 53.11,34.07 52.35,33.31 51.59,32.55 52.35,31.79 53.11,32.55 53.87,33.31 54.63,32.55 53.87,31.79 53.11,31.03 53.87,30.26 54.63,31.03 55.4,31.79 53.9,27.65 45.79,24.22 58.52,3.67 55.98,3.67 53.44,3.67 50.9,3.67 48.36,3.67 45.82,3.67 43.28,3.67 40.74,3.67 38.2,3.67 35.66,3.67 33.12,3.67 30.58,3.67 28.04,3.67 25.5,3.67 22.96,3.67 20.42,3.67 17.88,3.67 15.34,3.67 12.8,3.67 5.18,3.67 5.18,6.21 12.8,6.21 15.34,6.21 17.88,6.21 20.42,6.21 22.96,6.21 25.5,6.21 28.04,6.21 30.58,6.21 33.12,6.21 35.66,6.21 38.2,6.21 40.74,6.21 43.28,6.21 45.82,6.21 48.36,6.21 50.9,6.21 53.44,6.21 55.98,6.21 58.52,6.21 5.18,8.75 10.26,8.75 12.8,8.75 15.34,8.75 17.88,8.75 20.42,8.75 22.96,8.75 25.5,8.75 28.04,8.75 30.58,8.75 33.12,8.75 35.66,8.75 38.2,8.75 40.74,8.75 43.28,8.75 45.82,8.75 48.36,8.75 50.9,8.75 50.9,11.29 53.44,11.29 48.36,11.29 5.18,11.29 12.8,11.29 15.34,11.29 17.88,11.29 20.42,11.29 22.96,11.29 25.5,11.29 28.04,11.29 30.58,11.29 33.12,11.29 35.66,11.29 38.2,11.29 40.74,11.29 43.28,11.29 45.82,11.29 5.18,13.83 15.34,13.83 17.88,13.83 20.42,13.83 22.96,13.83 25.5,13.83 28.04,13.83 30.58,13.83 33.12,13.83 35.66,13.83 38.2,13.83 40.74,13.83 50.9,13.83 22.96,16.37 20.52,16.27 17.88,16.37 5.18,16.37 5.18,18.91 5.18,21.45 7.72,21.45 10.26,21.45 10.26,18.91 12.8,21.45 7.72,23.99 10.26,23.99 12.8,23.99 15.34,23.99 15.34,26.53 15.34,29.07 7.72,29.07 5.18,29.07 5.18,26.53 15.34,31.61 15.44,34.05 17.88,34.15 12.8,31.61 10.26,31.61 7.72,31.61 5.18,34.15 7.72,34.15 5.18,36.69 7.42,36.49 5.18,39.23 20.22,18.71 33.12,23.99 33.12,26.53 33.12,29.07 35.66,31.61 38.2,31.61 38.2,34.15 40.74,34.15 36.17,34.07 33.12,34.15 30.58,31.61 28.04,34.15 17.88,31.61 5.18,46.85 7.72,46.85 7.72,49.39 5.18,49.39 10.26,49.39 5.18,51.93 7.72,51.93 10.26,51.93 12.8,51.93 5.18,54.47 5.18,57.01 5.18,59.55 5.18,72.25 5.18,74.79 7.72,74.79 7.72,72.25 7.72,59.55 7.72,57.01 7.72,54.47 10.26,54.47 10.26,57.01 10.26,59.55 10.26,72.25 10.26,74.79 12.8,74.79 12.8,72.25 12.8,59.55 12.8,57.01 12.8,54.47 15.34,54.47 15.34,57.01 15.34,59.55 15.34,72.25 15.34,74.79 17.88,74.79 17.88,72.25 17.88,59.55 17.88,57.01 17.88,54.47 17.88,51.93 20.42,51.93 20.42,54.47 20.42,57.01 20.42,59.55 20.42,72.25 20.42,74.79 22.96,74.79 22.96,72.25 22.96,59.55 22.96,57.01 22.96,54.47 22.96,51.93 25.5,51.93 25.5,54.47 25.5,57.01 25.5,59.55 25.5,72.25 25.5,74.79 28.04,74.79 28.04,72.25 28.04,59.55 28.04,57.01 28.04,54.47 28.04,51.93 30.58,51.93 30.58,54.47 30.58,57.01 30.58,59.55 30.58,72.25 30.58,74.79 33.12,74.79 33.12,72.25 33.12,59.55 33.12,57.01 33.12,54.47 33.12,51.93 35.66,51.93 35.66,54.47 35.66,57.01 35.66,59.55 35.66,72.25 35.66,74.79 38.2,74.79 38.2,72.25 38.2,59.55 38.2,57.01 38.2,54.47 40.74,54.47 40.74,57.01 40.74,59.55 40.74,72.25 40.74,74.79 43.28,74.79 43.28,72.25 43.28,59.55 43.28,57.01 43.28,54.47 45.82,72.25 45.82,74.79 48.36,74.79 53.44,72.25 48.36,67.17 48.36,64.63 48.36,62.09 48.36,59.55 48.36,57.01 48.36,54.47 50.9,54.47 50.9,59.55 50.9,62.09 50.9,64.63 53.44,59.55 48.36,51.93 50.9,51.93 50.9,49.39 48.36,49.39 48.36,46.85 50.9,46.85 50.9,44.31 40.74,49.39 38.2,49.39 35.66,49.49 40.74,46.85 60.26,64.49 61.06,63.23 61.06,59.55 63.6,59.55 63.6,57.01 66.14,59.55 33.12,43.04 30.58,43.04 28.04,43.04 25.5,43.04 22.96,43.04 20.52,43.04 20.42,45.58 28.04,45.58 30.58,45.58 33.12,45.58 17.91,49.87 20.45,49.87 22.99,49.87 25.53,49.87 28.07,49.87 30.61,49.87 38.2,53.2 38.2,50.66 40.74,50.66 42.01,51.93 42.01,46.85 42.01,49.39 44.55,49.39 47.09,49.39 47.09,51.93 47.09,46.85 44.55,46.85 44.55,64.63 44.55,62.09 44.55,59.55 44.55,57.01 47.09,57.01 47.09,59.55 47.09,62.09 47.09,64.63 47.09,67.17 44.55,67.17 44.55,69.71 47.09,69.71 44.55,51.93 45.72,43.19 45.82,41.77 35.66,30.34 38.2,30.34 25.5,27.8 22.96,27.8 21.69,27.8 19.15,23.99 19.15,21.45 19.15,25.26 28.04,37.96 30.58,37.96 33.12,37.96 35.66,37.96 36.93,37.96 25.5,37.96 24.23,37.96 24.23,36.69 20.42,32.88 19.15,32.88 19.15,31.61 26.77,45.58 21.69,45.58 18.18,45.78 22.93,41.03 25.47,41.01 28.07,40.98 30.61,40.98 33.2,40.98 35.66,43.04 35.69,41.01 20.42,47.64 22.96,47.64 17.88,47.66 25.5,47.66 30.65,47.36 33.07,47.56 26.77,47.69 12.29,13.88 9.75,11.32 14.91,16.4 17.04,18.79 12.29,16.4 9.83,13.93 14.91,19.04 16.74,20.99 14.07,21.45 11.53,18.91 8.99,16.37 18.79,28.54 20.98,30.95 46.86,24.37 53.92,23.91 55.17,23.91 48.97,29.35
  pour Top (rank 2, no thermals): 3.77,77.66 3.77,2.18 75.06,2.18 75.06,77.66
  pour Route2 (rank 2, no thermals): 3.77,77.66 3.77,2.15 75.06,2.15 75.06,77.66
  pour Route15 (rank 2, no thermals): 3.77,77.66 3.77,2.18 75.06,2.18 75.06,77.66
  pour Bottom (isolate 0.508, rank 2, no thermals): 3.77,77.66 3.77,2.18 75.06,2.18 75.06,77.66
HALL_A
  Top 0.203: U$2.34 21.98,36.98 16.99,31.99 16.99,22.31 J4.3
HALL_B
  Top 0.203: J4.4 17.45,20.23 17.45,28.89 23.25,34.7 U$2.33
HALL_C
  Top 0.203: J4.5 17.9,18.14 17.9,26.1 24.52,32.72 U$2.32
INHA  (via drill 0.25)
  Top 0.203: J3.11 14.25,49.31 U$2.40 | IC1.34 49.06,35.68 v47.61,35.68
  Route15 0.203: U$2.40 32.4,50.89 v47.61,35.69 v47.61,35.68
INHB  (via drill 0.25)
  Top 0.203: J3.7 10.22,41.19 16.56,45.12 U$2.38 | IC1.36 49.11,34.21 v48.73,34.21
  Route15 0.203: v48.73,34.21 46.66,34.21 34.38,46.49 U$2.38
INHC  (via drill 0.25)
  Top 0.2: IC1.38 49.55,32 46.59,32 v46.1,32.49
  Top 0.203: J3.6 11.45,37.38 12.98,38.39 17.8,39.66 18.82,40.17 U$2.36
  Route15 0.203: v46.1,32.49 36.5,42.09 U$2.36
INLA  (via drill 0.25)
  Top 0.203: J3.9 14.78,46.83 14.87,47.93 U$2.39 | IC1.35 48.99,35.04 v48.25,35.04
  Route15 0.203: v48.25,35.04 47,35.04 33.34,48.69 U$2.39
INLB  (via drill 0.25)
  Top 0.2: IC1.37 49.25,32.4 47.31,32.4 v46.33,33.38
  Top 0.203: J3.8 10.18,39.59 12.16,40.73 14.37,43.28 16,44.29 U$2.37
  Route15 0.203: v46.33,33.38 35.42,44.29 U$2.37
INLC  (via drill 0.25)
  Top 0.2: IC1.39 49.83,31.57 v45.84,31.57
  Top 0.203: J3.4 12.21,34.86 14.22,36.03 18.63,37.34 19.62,37.85 19.79,38.16 20.71,39.86 U$2.35
  Route15 0.203: v45.84,31.57 37.52,39.89 U$2.35
ISENA
  Top 0.305: C10.1 55.34,56.96 R10.1 57.1,58.01 U$2.27
ISENB
  Top 0.305: C11.1 56.67,54.73 R11.1 U$2.28
ISENC
  Top 0.305: C12.1 R12.1 59.52,53.42 U$2.29
MISO
  Top 0.203: J3.1 U$2.14 21.2,38.84 49.35,38.84 | 49.35,38.84 49.44,38.84 IC1.29 | R20.1 49.35,38.84
MOSI  (via drill 0.25)
  Top 0.203: J3.3 U$2.15 | IC1.30 49.36,38.21 v45.98,38.21
  Route2 0.203: v45.98,38.21 45.17,38.21 44.22,39.15 21.87,39.15 21.34,38.62 U$2.15
N$1
  Top 0.2: 48.91,30.89 48.57,30.55 C15.2
  Top 0.3: 48.91,30.89 49.86,30.89 IC1.40
N$2
  Top 0.305: 26.99,22.89 LDO.5
  Top 1.27: JP1.1 21.6,22.91 C29.2 26.97,22.91 26.99,22.89
N$13
  Top 0.406: LDO.4 29.23,24.08 C28.2
N$14
  Top 0.3: C20.1 48.17,15 R17.1
N$16
  Top 0.406: LED1.A 28.28,29.04 R2.1
N$20
  Top 0.305: R3.2 C1.1
NFAULT  (via drill 0.25, 0.35)
  Top 0.203: IC1.28 50.62,38.36 v50.62,38.62 | LED1.C 29.86,30.35 v29.87,30.36
  Top 0.406: R1.1 29.8,29.07 LED1.C
  Route2 0.203: U$2.12 22.32,32.75 26.79,37.21 31.61,37.21 | v50.62,38.62 50.62,36.41 50.31,36.1 48.29,36.1 47.18,37.21 31.61,37.21 | v29.87,30.36 29.87,35.47 31.61,37.21
PGND
  Top 0.305: U$2.2 53.05,70.26 54.74,70.26 56.02,71.54 | R5.1 56.02,71.54 | 56.55,70.53 TP19.TP 56.69,70.87 56.02,71.54
RCL
  Top 0.254: IC1.46 52.23,29.02 52.23,26.7 49.92,24.38 R13.2
RT/SD
  Top 0.254: IC1.47 52.69,28.77 52.69,25.13 50.48,22.92 R14.2
SCLK  (via drill 0.25)
  Top 0.203: J3.5 20.09,43.98 34.53,49.92 | 34.53,49.92 34.69,49.99 | IC1.31 49.29,37.57 v49.02,37.57 | U$2.7 56.92,59.22 46.51,54.9 | 34.53,49.92 46.51,54.9 | v45.01,39.47 43.2,41.27 43.2,51.59 46.51,54.9
  Route15 0.203: v49.02,37.57 47.12,39.47 v45.01,39.47
SLA
  Top 0.3: U$3.SLAH 64.21,29.9 62.16,31.94 58.45,31.94 IC1.11
SLB
  Top 0.3: IC1.14 | IC1.14 58.44,34.53 64.77,34.53 67.63,31.67 U$3.SLB
SLC
  Top 0.3: IC1.21 63.09,44.12 U$3.SLCH
SOA
  Top 0.3: R10.2 53.87,55.84 53.08,55.05 53.08,48.81 55.99,45.9 U$3.SOAH
SOB
  Top 0.3: R11.2 55.17,53.6 54.27,52.7 54.27,49.42 56.02,47.68 U$3.SOBH
SOC
  Top 0.3: R12.2 55.6,50.77 55.6,49.9 56.4,49.1 70.62,49.1 U$3.SOCH
SW
  Top 0.3: IC1.42 50,29.62 50,29.1
  Top 0.305: C18.1 46.01,27.6 40.8,27.6 L3.P$2 | 50,29.1 48.48,27.59 47.98,27.59
  Top 0.508: 47.98,27.59 46.63,27.59 C18.1
  pour Top (no thermals): 36.32,21.95 36.32,27.97 47.28,27.97 47.28,26.72 45.11,26.72 45.11,21.95
VBUCK
  Top 0.406: C27.2 31.25,20.39 LDO.3
  pour Top (isolate 0.254, no thermals): 26.21,16.09 26.21,21.22 57.05,21.22 57.05,16.09
VCC
  Top 0.3: IC1.44 51.3,29.5 51.3,28.84 C17.2
  Top 0.305: 50.55,28.53 C17.2
VCP
  Top 0.3: C22.2 58.23,29.33 IC1.7
VDRAIN  (via drill 0.2, 0.35)  (2 unrouted)
  Top 0.3: IC1.6 58.76,28.1 C22.1 | IC1.43 50.65,29.56 v50.65,29.32 | U$3.VDRAIN2 70.5,73.8 61,73.8 60.98,73.8 60.96,73.8 R18.2
  Top 0.305: v46.89,22.87 46.94,22.92 R14.1 | R18.2 60.21,73.85
  Top 0.508: C13.1 44.19,29.15 v44.3,29.05 45.56,29.05 C14.2 | v60.81,27.27 60.81,27.32 C22.1
  Route15 0.254: U$3.VDRAINH2 72.3,20.18 72.3,20.2
  Route15 4.445: 72.3,20.2 60.84,20.2 60.77,20.27
  pour Route15 (no thermals): 40.97,23.48 40.97,30.85 62.91,30.85 62.91,16.09 48.36,16.09
  pour Route15: 69.7,22.8 74.8,22.8 74.8,17.7 69.7,17.7
VGLS
  Top 0.3: 55.26,27.01 55.26,28.77 IC1.2
  Top 0.305: 55.26,27.01 C16.2
VSENA  (via drill 0.35)
  Top 0.203: 60.38,67.87 60.39,67.76 60.2,67.64 TVS_DIODE.D1+ TVS_DIODE.P$6 57.85,66.28 57.36,66.28 v57.21,66.19 v57.2,66.2
  Top 0.3: R25.2 60.62,69.55
  Top 0.305: R24.1 60.23,69.35 60.33,68.4 60.38,67.87
  Top 0.406: C34.1 60.62,69.55 R24.1
  Route15 0.203: U$2.30 60.99,54.02 55.66,63.25 55.66,64.26 57.2,65.8 v57.2,66.2
VSENB
  Top 0.203: 60.15,66.46 60.81,66.84 60.89,66.78 | 60.15,66.46 TVS_DIODE.D0- | 60.15,66.46 TVS_DIODE.P$7 58.27,65.36 58.19,65.32 58.2,65.2
  Top 0.3: R27.1 R26.2
  Top 0.305: R27.1 62.05,65.9 61.4,66.4 60.89,66.78 | U$2.25 56.34,61.94 58.34,63.08 58.2,65.2
  Top 0.406: C35.1 R27.1
VSENC
  Top 0.203: 60.82,66.15 60.76,66.23 TVS_DIODE.D0+ TVS_DIODE.P$8 59.08,65.27 59.09,65.19
  Top 0.3: R28.1 R29.2
  Top 0.305: U$2.26 57.63,59.83 59.64,60.84 59.15,64.68 59.09,65.19 | R28.1 63.85,62.44 61.22,65.66 60.82,66.15
  Top 0.406: C36.1 64.53,62.78 R28.1
VSENVM
  Top 0.203: 59.74,68.11 59.79,67.98 TVS_DIODE.D1- TVS_DIODE.P$5 58.05,66.98 57.96,67.04
  Top 0.305: U$2.23 52.55,68.49 54.46,69.69 57.46,67.35 57.96,67.04 | R18.1 57.95,72.53 59.36,69.04 59.74,68.11
  Top 0.406: C24.1 58.69,72.93 R18.1 R19.2

### Text on the board
tNames: PGND | MADE FOR SEM BY / RICE ELECTRIC VEHICLE / 2019-2020 | SOA | GLC | GHC | AGND | SOB | SPC | SNC | BPHASE | SPB | SNB | SNA | SPA | GLA | DRVM | GHA | APHASE